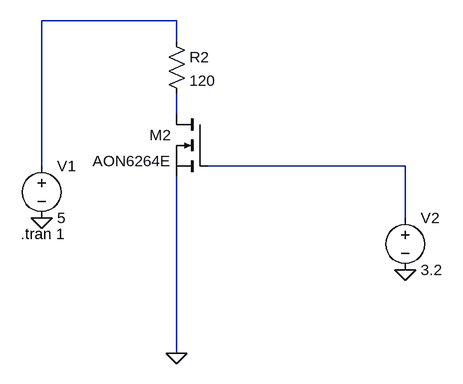
[diagram p0: schematic fanDriver.asc]
fanDriver.asc, the LTspice schematic file:
Version 4
SHEET 1 1016 680
WIRE 288 -64 80 -64
WIRE 288 -32 288 -64
WIRE 288 80 288 48
WIRE 80 160 80 -64
WIRE 640 160 336 160
WIRE 640 240 640 160
WIRE 288 448 288 176
FLAG 80 240 0
FLAG 288 448 0
FLAG 640 320 0
SYMBOL voltage 80 144 R0
WINDOW 123 0 0 Left 0
WINDOW 39 0 0 Left 0
SYMATTR InstName V1
SYMATTR Value 5
SYMBOL res 272 -48 R0
SYMATTR InstName R2
SYMATTR Value 120
SYMBOL voltage 640 224 R0
WINDOW 123 0 0 Left 0
WINDOW 39 0 0 Left 0
SYMATTR InstName V2
SYMATTR Value 3.2
SYMBOL nmos 336 80 M0
SYMATTR InstName M2
SYMATTR Value AON6264E
TEXT 48 264 Left 2 !.tran 1

The netlist it stands for:
* fanDriver.asc
V1 N001 0 5
R2 N001 N002 120
V2 N003 0 3.2
M2 N002 N003 0 0 AON6264E
.model NMOS NMOS
.model PMOS PMOS
.lib standard.mos
.tran 1
.backanno
.end